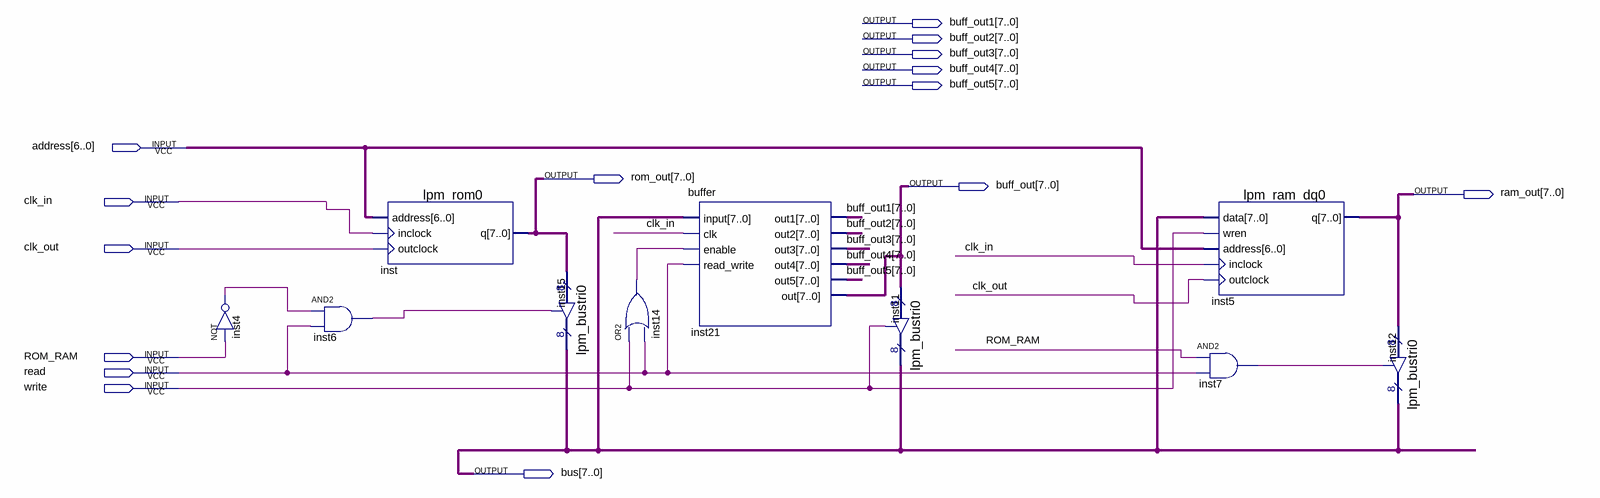
[diagram p0: schematic sheet]
// Quartus schematic main.bdf as structural Verilog: 10 symbols, 15 pins
module main (
  input  [6:0] address,
  input  clk_in,
  input  clk_out,
  input  ROM_RAM,
  input  read,
  input  write,
  output [7:0] buff_out1,
  output [7:0] buff_out2,
  output [7:0] buff_out3,
  output [7:0] buff_out4,
  output [7:0] buff_out5,
  output [7:0] rom_out,
  output [7:0] buff_out,
  output [7:0] ram_out,
  output [7:0] bus
);

  wire inst4_out, inst6_out, inst7_out, inst14_out;

  not inst4 (inst4_out, ROM_RAM);
  and inst6 (inst6_out, inst4_out, read);
  lpm_rom0 inst (.address(address), .inclock(clk_in), .outclock(clk_out), .q(rom_out));
  lpm_bustri0 inst15 (.enabledt(inst6_out), .data(rom_out), .tridata(bus));
  or inst14 (inst14_out, write, read);
  buffer inst21 (
    .\input (bus), .clk(clk_in), .enable(inst14_out), .read_write(read), .out1(buff_out1), .out2(buff_out2),
    .out3(buff_out3), .out4(buff_out4), .out5(buff_out5), .out(buff_out));
  lpm_bustri0 inst11 (.enabledt(write), .data(buff_out), .tridata(bus));
  lpm_ram_dq0 inst5 (.data(bus), .wren(write), .address(address), .inclock(clk_in), .outclock(clk_out), .q(ram_out));
  and inst7 (inst7_out, ROM_RAM, read);
  lpm_bustri0 inst12 (.enabledt(inst7_out), .data(ram_out), .tridata(bus));
endmodule
